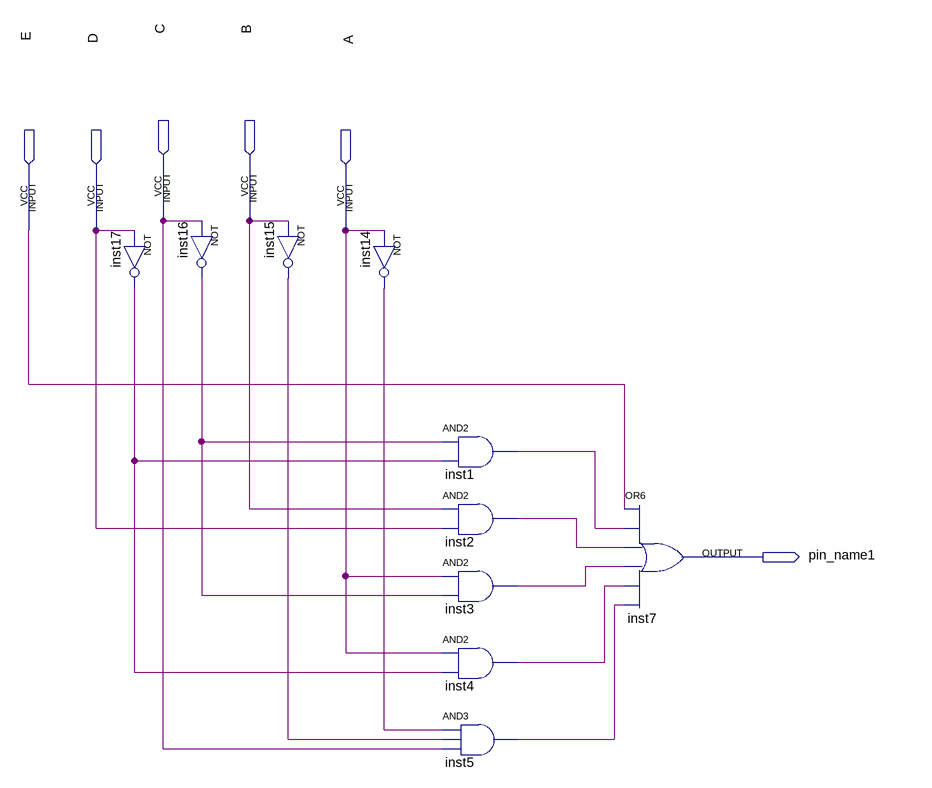
[diagram p0: schematic sheet]
// Quartus schematic decod2-3.bdf as structural Verilog: 10 symbols, 6 pins
module \decod2-3  (
  input  C,
  input  B,
  input  E,
  input  D,
  input  A,
  output pin_name1
);

  wire inst1_out, inst2_out, inst3_out, inst4_out, inst5_out, inst14_out, inst15_out, inst16_out, inst17_out;

  not inst17 (inst17_out, D);
  not inst16 (inst16_out, C);
  not inst15 (inst15_out, B);
  not inst14 (inst14_out, A);
  and inst1 (inst1_out, inst16_out, inst17_out);
  and inst2 (inst2_out, B, D);
  and inst3 (inst3_out, A, inst16_out);
  and inst4 (inst4_out, A, inst17_out);
  and inst5 (inst5_out, inst14_out, inst15_out, C);
  or inst7 (pin_name1, E, inst1_out, inst2_out, inst3_out, inst4_out, inst5_out);
endmodule
